# Altium schematic sheet Spolerigg3.SchDoc: TK531 Utgangstrinn
size A4; Author: Øystein Smith; Organization: Omega Verksted; DocumentNumber: 18; Revision: 2; SheetNumber: 18; SheetTotal: 20
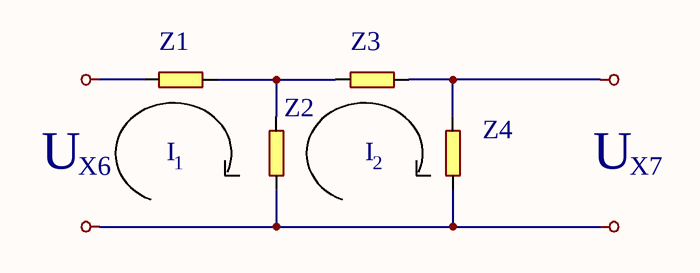
[diagram p0: Spolerigg3.SchDoc]

## Parts
Z1  1.0  [RESA_0.25W]  (value not drawn)
Z2  1.0  [RESA_0.25W]  (value not drawn)
Z3  1.0  [RESA_0.25W]  (value not drawn)
Z4  1.0  [RESA_0.25W]  (value not drawn)

## Nets
GND: Z2.1 Z4.1
IN: Z1.1
OUT: Z3.2 Z4.2
NetZ1_2: Z1.2 Z2.2 Z3.1

## Notes on the sheet
- U
- X6
- (near Z1) I
- 1
- I
- 2
- X7
- Size:
- Date:
- Title:
- A3
- Revision:
- Sheet
- of
- Author:
- File:

## Library data of the parts
Z1-Z4 = 2747: 0.25W 1% Generic resistor; id: 2747; rad: 0; rom: OV; lager_type: Fremlager; hylle: 8; antall: 100; pakke_opprettet_av: 815; pakke_opprettet: 28.06.2014 17.13.33; symbol_opprettet: 08.07.2014 21.16.33; nokkelord: Motstand, Resistor; pakketype: TH; dybde: 0; kolonne: 0; symbol_opprettet_av: 815; navn: 1.0; pris: 0